# Altium schematic sheet CarteTxMoteur.SchDoc
size A4
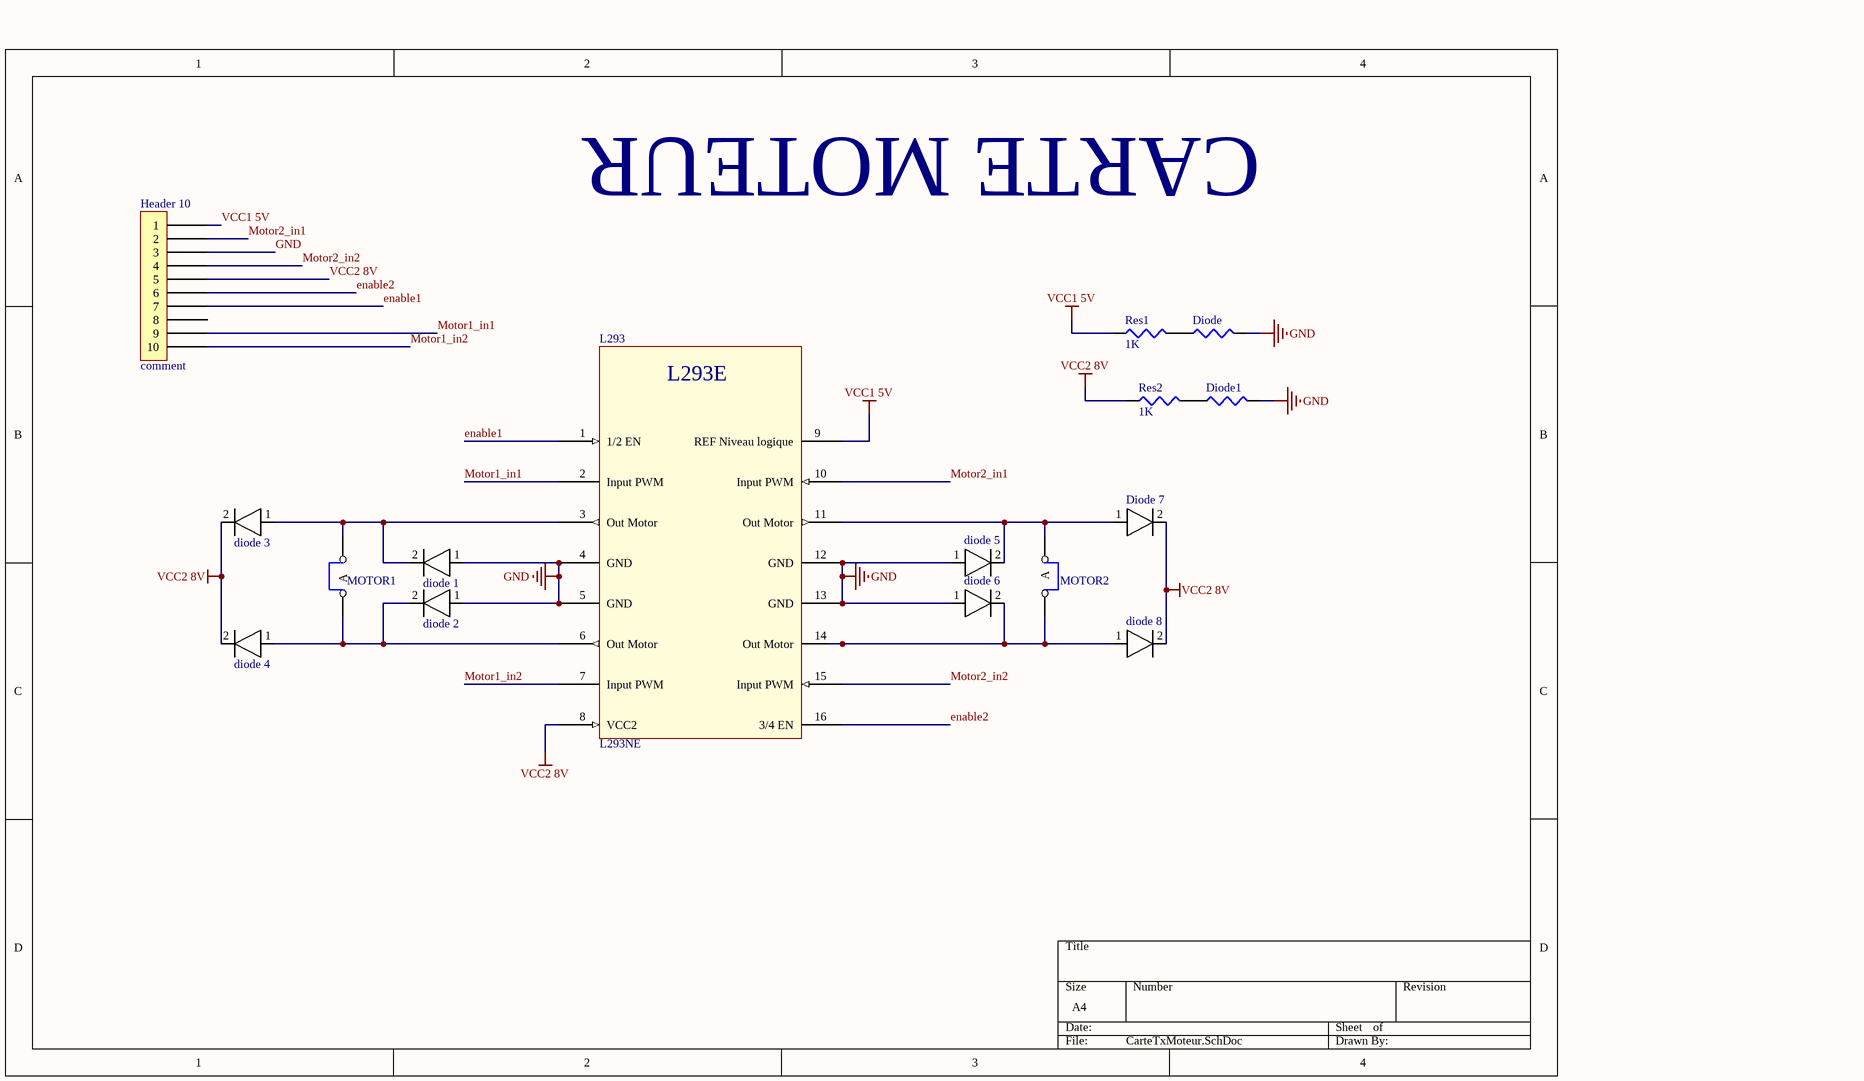
[diagram p0: CarteTxMoteur.SchDoc]

## Parts
Diode  RES  [1206]  (value not drawn)
Diode1  RES  [1206]  (value not drawn)
diode_1  DiodeRedresseuse  [Diode MULTICOMP SS16]  (value not drawn)
diode_2  DiodeRedresseuse  [Diode MULTICOMP SS16]  (value not drawn)
diode_3  DiodeRedresseuse  [Diode MULTICOMP SS16]  (value not drawn)
diode_4  DiodeRedresseuse  [Diode MULTICOMP SS16]  (value not drawn)
diode_5  DiodeRedresseuse  [Diode MULTICOMP SS16]  (value not drawn)
diode_6  DiodeRedresseuse  [Diode MULTICOMP SS16]  (value not drawn)
Diode_7  DiodeRedresseuse  [Diode MULTICOMP SS16]  (value not drawn)
diode_8  DiodeRedresseuse  [Diode MULTICOMP SS16]  (value not drawn)
Header_10  comment  [HE10-10V]
L293  L293NE  [L293NE]
MOTOR1  JUMPER2  [JMP2-100]  (value not drawn)
MOTOR2  JUMPER2  [JMP2-100]  (value not drawn)
Res1  value 1K  [0805]  (hidden comment: RES)
Res2  value 1K  [0805]  (hidden comment: RES)

## Nets
GND: Diode.2 Diode1.2 diode_1.1 diode_2.1 diode_5.1 diode_6.1 Header_10.3 L293.4(GND) L293.5(GND) L293.12(GND) L293.13(GND)
VCC1 5V: Header_10.1 L293.9(REF_Niveau_logique) Res1.1
VCC2 8V: diode_3.2 diode_4.2 Diode_7.2 diode_8.2 Header_10.5 L293.8(VCC2) Res2.1
enable1: Header_10.7 L293.1(1/2_EN)
enable2: Header_10.6 L293.16(3/4_EN)
Motor1_in1: Header_10.9 L293.2(Input_PWM)
Motor1_in2: Header_10.10 L293.7(Input_PWM)
Motor2_in1: Header_10.2 L293.10(Input_PWM)
Motor2_in2: Header_10.4 L293.15(Input_PWM)
NetDiode1_1: Diode1.1 Res2.2
NetDiode_1: Diode.1 Res1.2
Netdiode_1_2: diode_1.2 diode_3.1 L293.3(Out_Motor) MOTOR1.2(com)
Netdiode_2_2: diode_2.2 diode_4.1 L293.6(Out_Motor) MOTOR1.1(A)
Netdiode_5_2: diode_5.2 Diode_7.1 L293.11(Out_Motor) MOTOR2.1(A)
Netdiode_6_2: diode_6.2 diode_8.1 L293.14(Out_Motor) MOTOR2.2(com)

Not connected (* = marked no-connect by the designer): Header_10 8

## Notes on the sheet
- CARTE MOTEUR
- (in symbol L293NE) L293E

## Library data of the parts
Diode Diode1 = RES: resistance; Value: 1K
Header_10 = HE10-10: 10-pin connector
MOTOR1 MOTOR2 = JUMPER2: cavalier 1 position
Res1 Res2 = RES: resistance